# EAGLE design H26R00 (EAGLE 9.3.0)

## Sheet 1 of 2
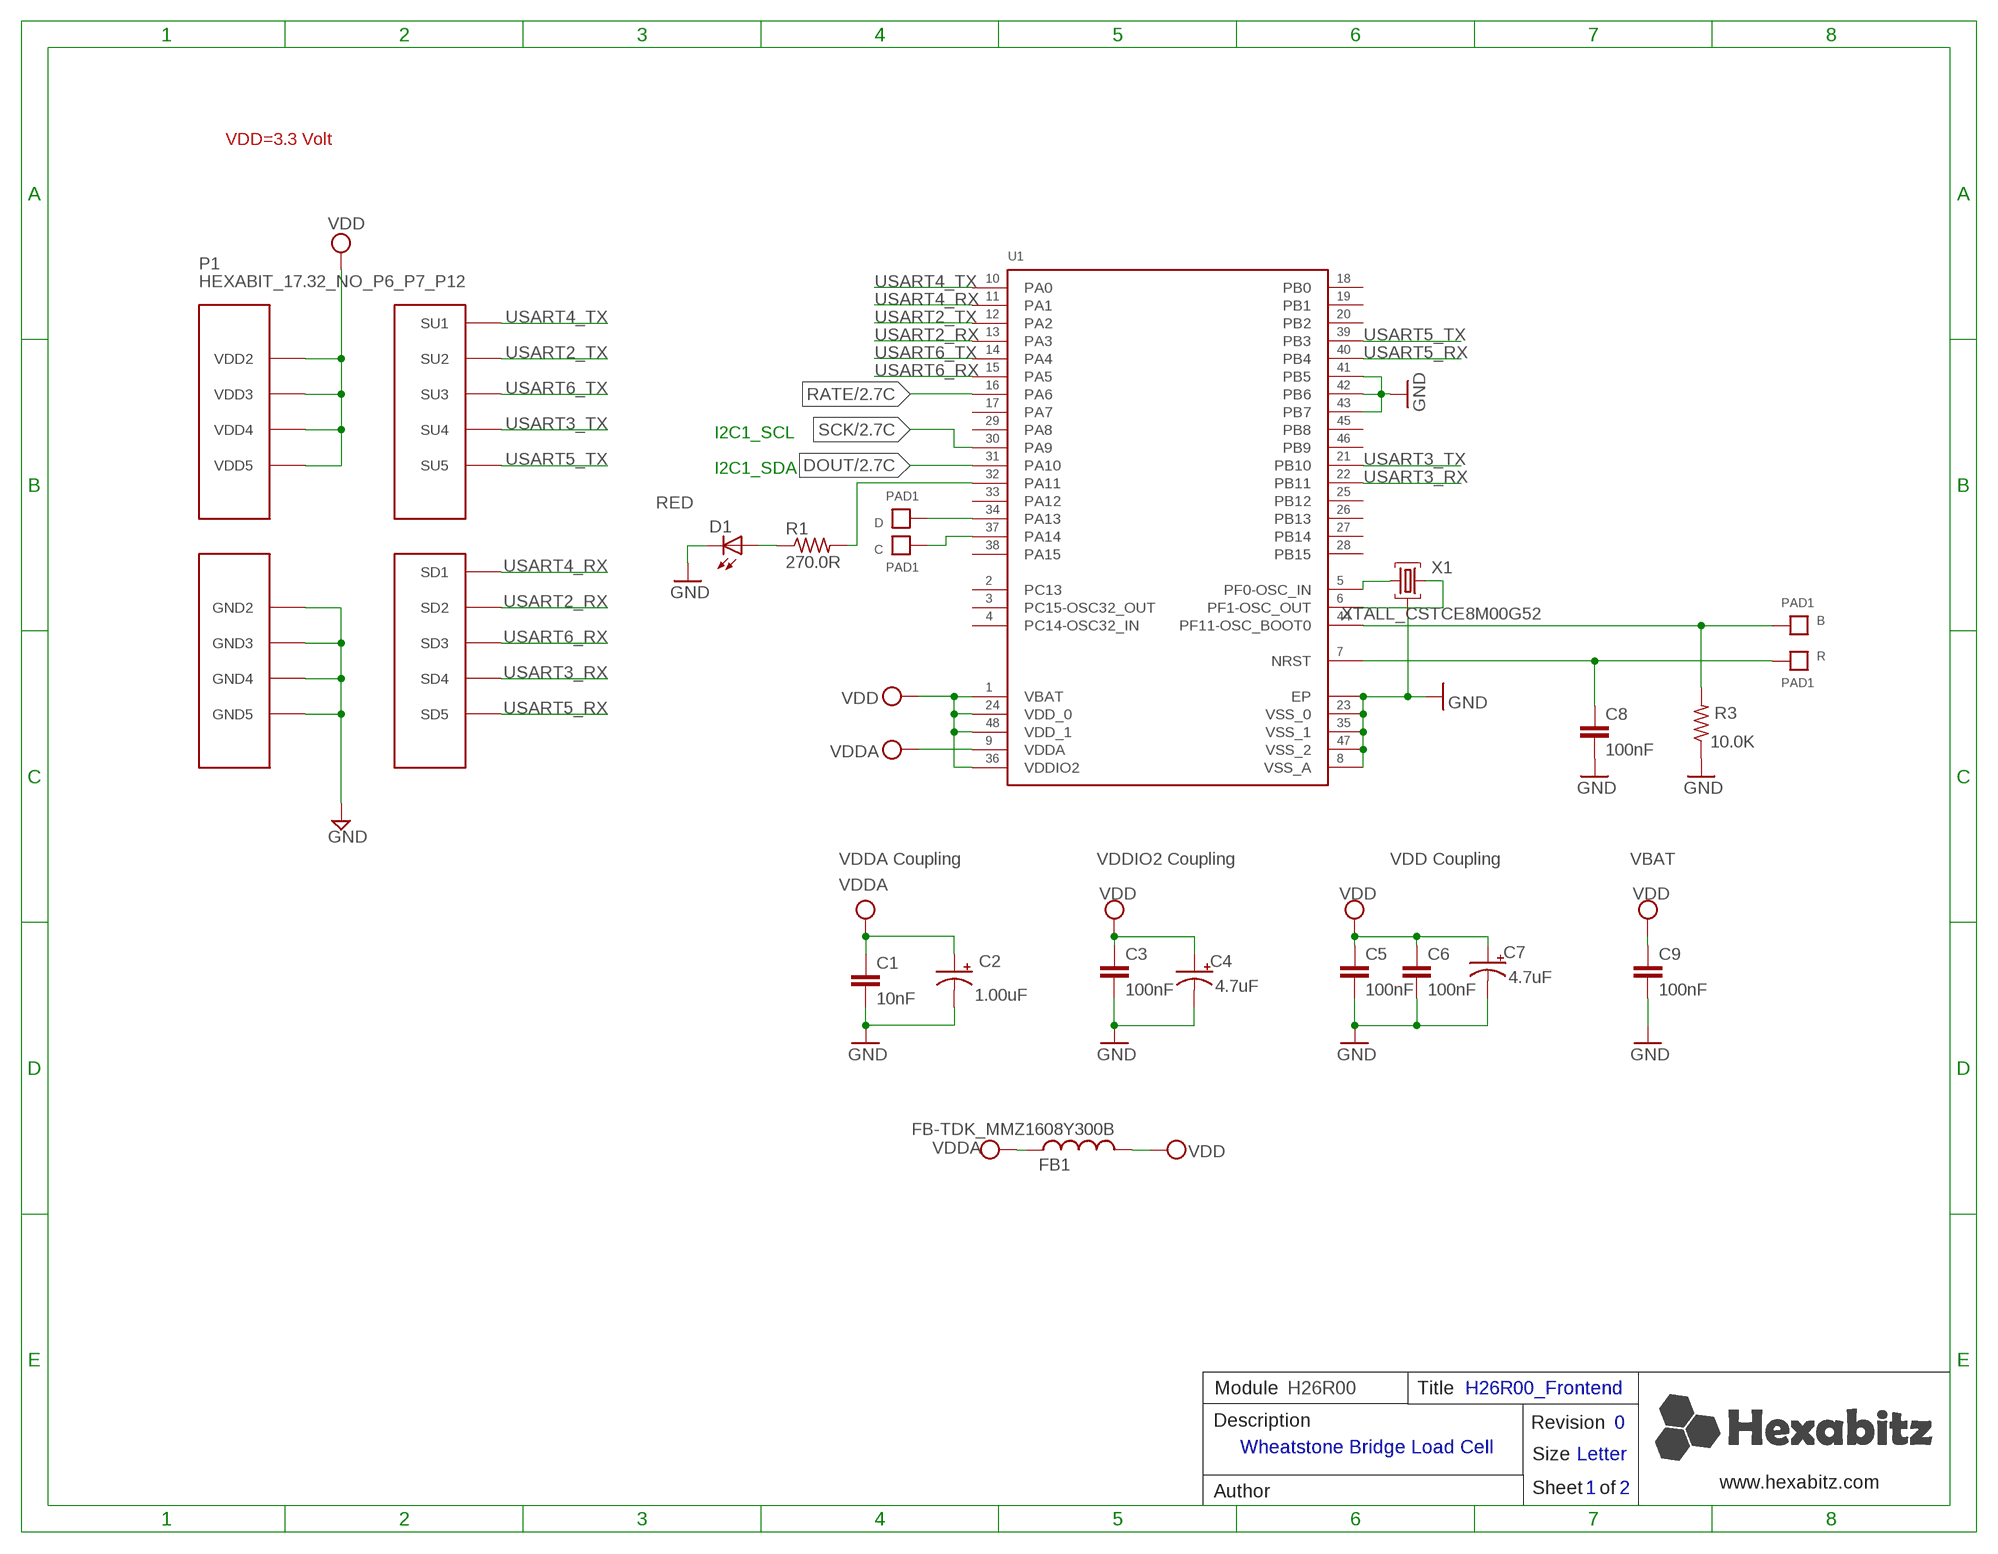
[diagram p0: schematic, sheet 1]

### Parts
B  PAD1  [PAD1]
C  PAD1  [PAD1]
C1  10nF  C-0603  [C-0603]
C2  1.00uF  C-0805-POL  [C-0805-POL]
C3  100nF  C-0603  [C-0603]
C4  4.7uF  C-0805-POL  [C-0805-POL]
C5  100nF  C-0603  [C-0603]
C6  100nF  C-0603  [C-0603]
C7  4.7uF  C-0805-POL  [C-0805-POL]
C8  100nF  C-0603  [C-0603]
C9  100nF  C-0603  [C-0603]
D  PAD1  [PAD1]
D1  RED  VLMS1300-GS08  [VLMS1300-GS08]
FB1  FB-TDK_MMZ1608Y300B  [FB-TDK_MMZ1608Y300B]
P1  HEXABIT_17.32_NO_P6_P7_P12  [HEXABIT_17.32_NO_P6_P7_P12]
R  PAD1  [PAD1]
R1  270.0R  R-0603  [R-0603]
R3  10.0K  R-0603  [R-0603]
U1  STM32F091CBU6  [STM32F091CBU6]
X1  XTALL_CSTCE8M00G52  [XTALL_CSTCE8M00G52]

### Nets
B1: B.P$1 B.P$2 R3.2 U1.P$44(PF11-OSC_BOOT0)
DOUT: U1.P$31(PA10) ; also sheet 2
GND: C1.2 C2.2(-) C3.2 C4.2(-) C5.2 C6.2 C7.2(-) C8.2 C9.2 D1.C P1.PAD_PD8(GND2) P1.PAD_PD9(GND3) P1.PAD_PD10(GND4) P1.PAD_PD11(GND5) R3.1 U1.EP U1.P$8(VSS_A) U1.P$23(VSS_0) U1.P$35(VSS_1) U1.P$41(PB5) U1.P$42(PB6) U1.P$43(PB7) U1.P$47(VSS_2) X1.P$2 ; also sheet 2
N$2: R1.2 U1.P$32(PA11)
N$4: D1.A R1.1
N$5: U1.P$5(PF0-OSC_IN) X1.P$1
N$6: U1.P$6(PF1-OSC_OUT) X1.P$3
N$7: D.P$1 D.P$2 U1.P$34(PA13)
N$9: C.P$1 C.P$2 U1.P$37(PA14)
R1: C8.1 R.P$1 R.P$2 U1.P$7(NRST)
RATE: U1.P$16(PA6) ; also sheet 2
SCK: U1.P$30(PA9) ; also sheet 2
USART2_RX: P1.PAD_PD2(SD2) U1.P$13(PA3)
USART2_TX: P1.PAD_PU2(SU2) U1.P$12(PA2)
USART3_RX: P1.PAD_PD4(SD4) U1.P$22(PB11)
USART3_TX: P1.PAD_PU4(SU4) U1.P$21(PB10)
USART4_RX: P1.PAD_PD1(SD1) U1.P$11(PA1)
USART4_TX: P1.PAD_PU1(SU1) U1.P$10(PA0)
USART5_RX: P1.PAD_PD5(SD5) U1.P$40(PB4)
USART5_TX: P1.PAD_PU5(SU5) U1.P$39(PB3)
USART6_RX: P1.PAD_PD3(SD3) U1.P$15(PA5)
USART6_TX: P1.PAD_PU3(SU3) U1.P$14(PA4)
VDD: C3.1 C4.1(+) C5.1 C6.1 C7.1(+) C9.1 FB1.2 P1.PAD_PU8(VDD2) P1.PAD_PU9(VDD3) P1.PAD_PU10(VDD4) P1.PAD_PU11(VDD5) U1.P$1(VBAT) U1.P$24(VDD_0) U1.P$36(VDDIO2) U1.P$48(VDD_1) ; also sheet 2
VDDA: C1.1 C2.1(+) FB1.1 U1.P$9(VDDA)
Unconnected: U1.P$2(PC13) U1.P$3(PC14-OSC32_IN) U1.P$4(PC15-OSC32_OUT) U1.P$17(PA7) U1.P$18(PB0) U1.P$19(PB1) U1.P$20(PB2) U1.P$25(PB12) U1.P$26(PB13) U1.P$27(PB14) U1.P$28(PB15) U1.P$29(PA8) U1.P$33(PA12) U1.P$38(PA15) U1.P$45(PB8) U1.P$46(PB9)

### Notes on the sheet
- VDD=3.3 Volt
- I2C1_SCL
- I2C1_SDA
- VDDA Coupling | VDDIO2 Coupling | VDD Coupling | VBAT
- Module | H26R00 | Title | H26R00_Frontend
- Description | Revision | 0
- Wheatstone Bridge Load Cell
- Size | Letter
- www.hexabitz.com
- Author | Sheet   of | 1 | 2
- C:/Users/Admin/Desktop/logodraft.bmp

## Sheet 2 of 2
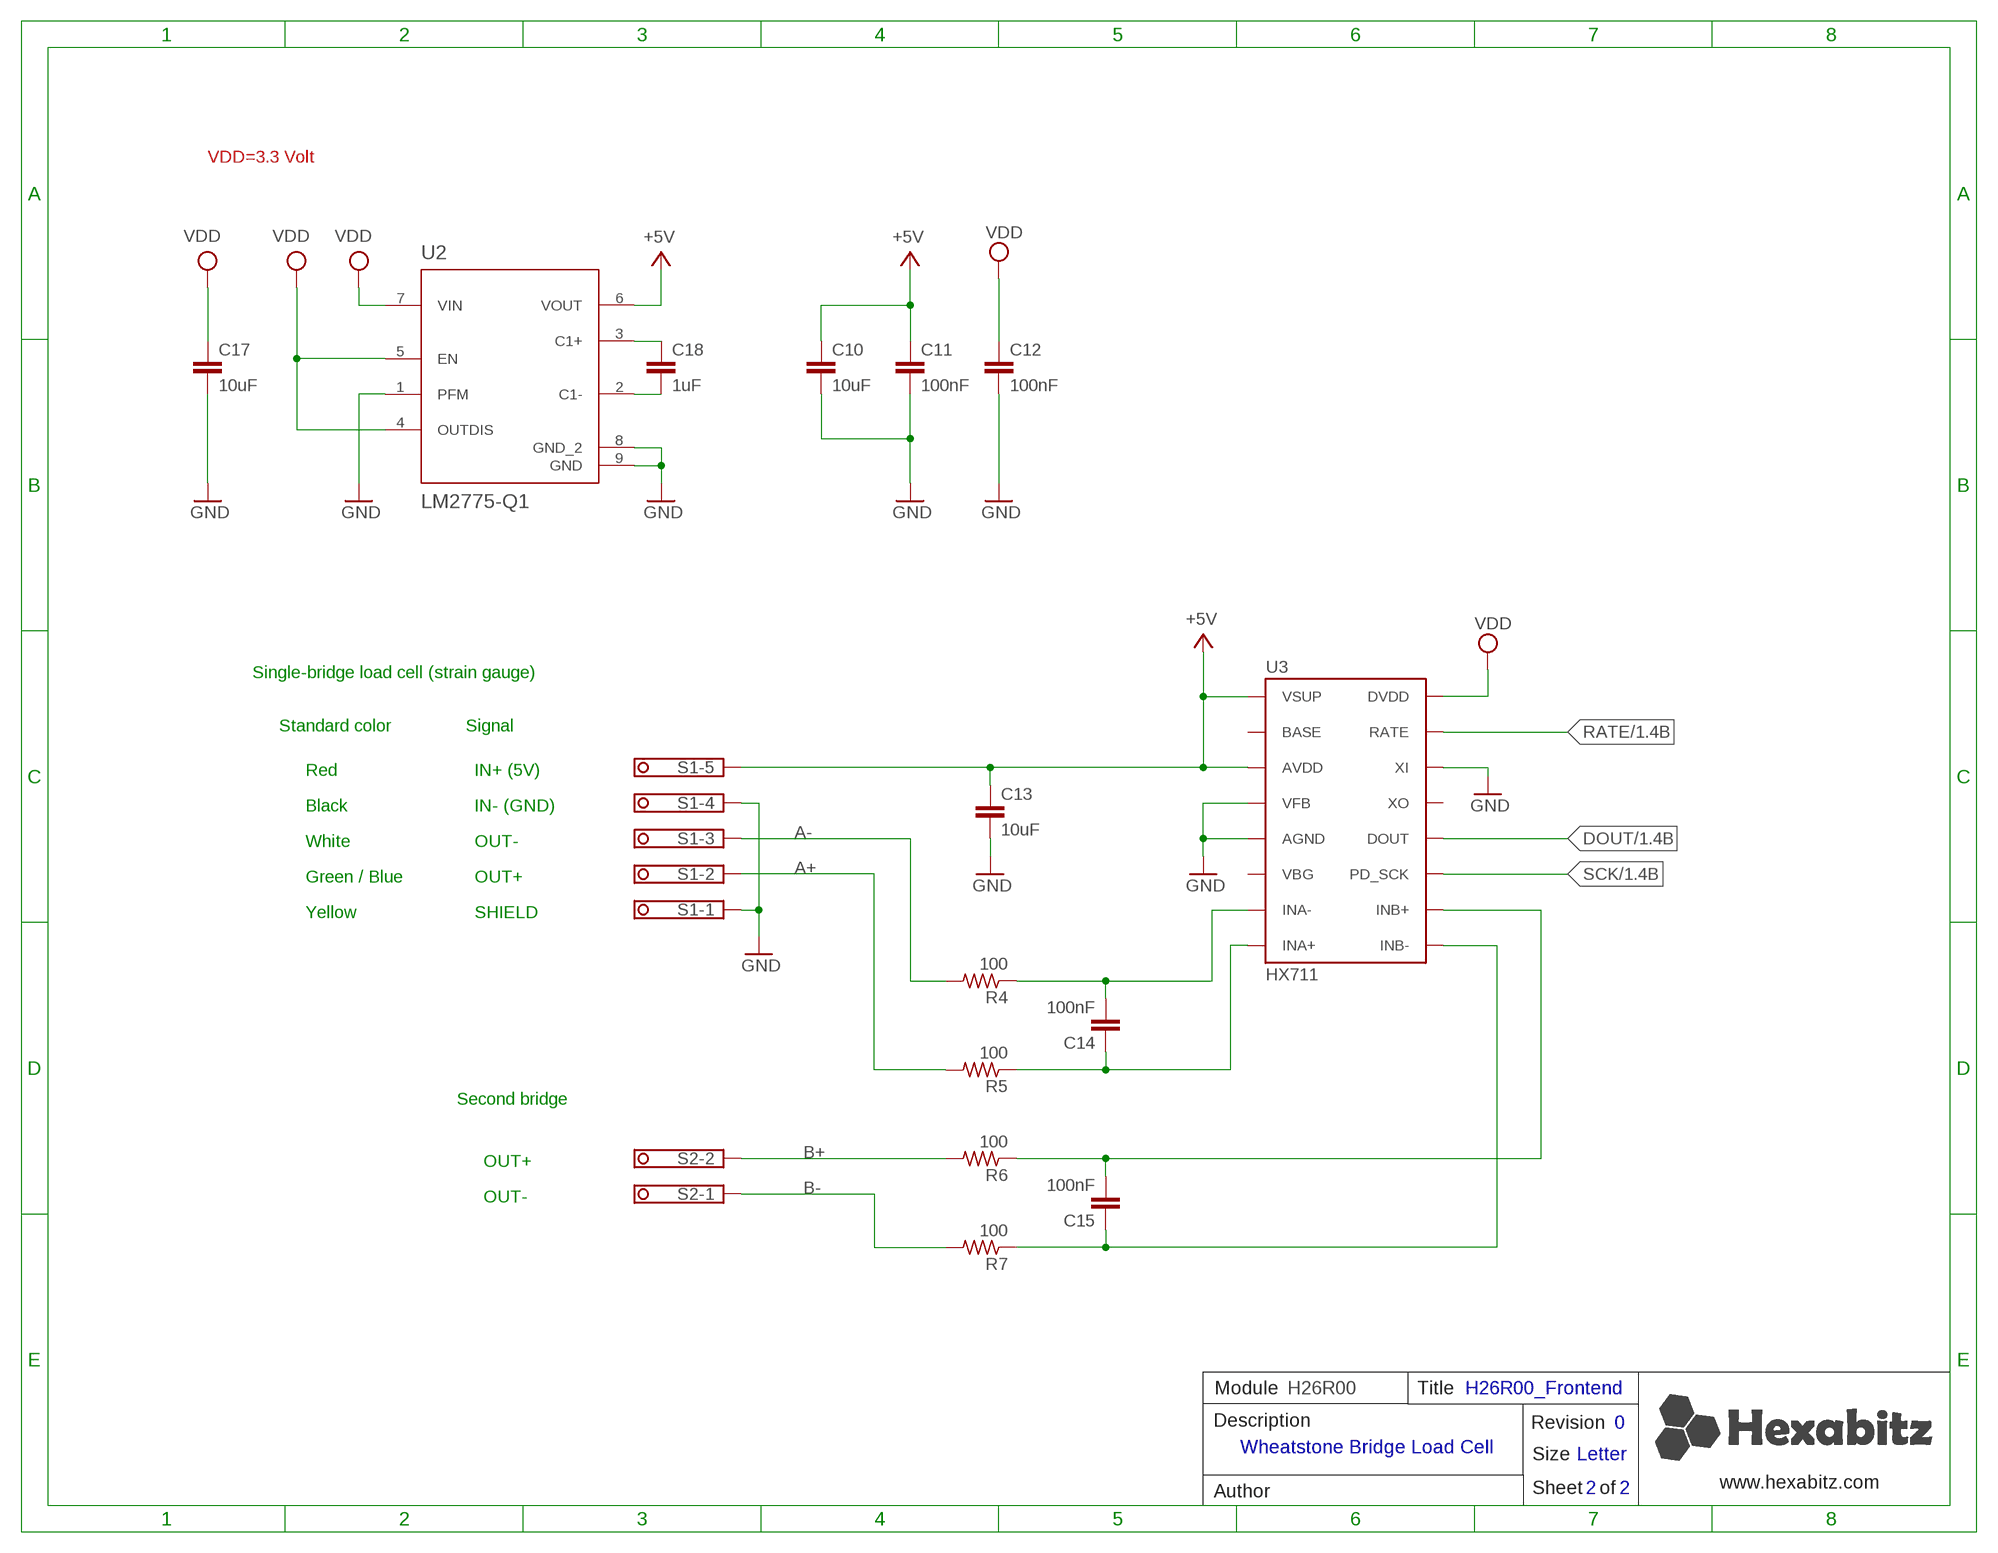
[diagram p1: schematic, sheet 2]

### Parts
C10  10uF  C-0603  [C-0603]
C11  100nF  C-0603  [C-0603]
C12  100nF  C-0603  [C-0603]
C13  10uF  C-0603  [C-0603]
C14  100nF  C-0603  [C-0603]
C15  100nF  C-0603  [C-0603]
C17  10uF  C-0603  [C-0603]
C18  1uF  C-0603  [C-0603]
R4  100  R-0603  [R-0603]
R5  100  R-0603  [R-0603]
R6  100  R-0603  [R-0603]
R7  100  R-0603  [R-0603]
S1  CON-PHOENIX-350_1751277  [CON-PHOENIX-350_1751277]
S2  CON-PHOENIX-350_1751248  [CON-PHOENIX-350_1751248]
U2  LM2775-Q1  LM2775QDSGRQ1  [DSG0008A]
U3  HX711  [HX711_SO16]

### Nets
+5V: C10.1 C11.1 C13.1 S1.5 U2.6(VOUT) U3.1(VSUP) U3.3(AVDD)
A+: R5.2 S1.2
A-: R4.2 S1.3
B+: R6.2 S2.2
B-: R7.2 S2.1
DOUT: U3.12(DOUT) ; also sheet 1
GND: C10.2 C11.2 C12.2 C13.2 C17.2 S1.1 S1.4 U2.1(PFM) U2.8(GND_2) U2.9(GND) U3.4(VFB) U3.5(AGND) U3.14(XI) ; also sheet 1
INA+: C14.1 R5.1 U3.8(INA+)
INA-: C14.2 R4.1 U3.7(INA-)
INB+: C15.2 R6.1 U3.10(INB+)
INB-: C15.1 R7.1 U3.9(INB-)
N$3: C18.1 U2.3(C1+)
N$13: C18.2 U2.2(C1-)
RATE: U3.15(RATE) ; also sheet 1
SCK: U3.11(PD_SCK) ; also sheet 1
VDD: C12.1 C17.1 U2.4(OUTDIS) U2.5(EN) U2.7(VIN) U3.16(DVDD) ; also sheet 1
Unconnected: U3.2(BASE) U3.6(VBG) U3.13(XO)

### Notes on the sheet
- VDD=3.3 Volt
- Single-bridge load cell (strain gauge)
- Standard color | Signal
- Red | IN+ (5V)
- Black | IN- (GND)
- White | OUT-
- Green / Blue | OUT+
- Yellow | SHIELD
- Second bridge
- OUT+
- OUT-
- Module | H26R00 | Title | H26R00_Frontend
- Description | Revision | 0
- Wheatstone Bridge Load Cell
- Size | Letter
- www.hexabitz.com
- Author | Sheet   of | 2 | 2

## Library data of the parts
B C D R = Hexabitz:PAD1
C1 = Hexabitz:C-0603: CAP CER 10% X7R 0603; CAPACITANCE: 10nF; MFN: KEMET; MPN: C0603C103K5RACTU; OCTOPART_URL: https://octopart.com/c0603c103k5ractu-kemet-133094?r=sp&s=R_iPBxLnSmGqhkU2rIMFpg; TOLERANCE: 10%; VOLTAGE_RATING: 50V
C2 = Hexabitz:C-0805-POL: Cap Tant Solid SMD 2012; CAPACITANCE: 1.00uF; MFN: Yageo; MPN: CC0805KKX7R7BB105; OCTOPART_URL: https://octopart.com/cc0805kkx7r7bb105-yageo-8376555?r=sp&s=YKl1wwtkROau_X5nniH2ig; TOLERANCE: 10%; VOLTAGE_RATING: 16V
C3 C6 C8 C11 C12 = Hexabitz:C-0603: CAP CER 10% X7R 0603; CAPACITANCE: 100nF; MFN: KEMET; MPN: C0603C104K8RACTU; OCTOPART_URL: https://octopart.com/c0603c104k8ractu-kemet-145075?r=sp&s=9bS9ASSwSEqMCE9KBEQZ0g; TOLERANCE: 10%; VOLTAGE_RATING: 10V
C4 C7 = Hexabitz:C-0805-POL: Cap Tant Solid SMD 2012; CAPACITANCE: 4.7uF; MFN: Murata; MPN: GRM21BC81E475KA12L; OCTOPART_URL: https://octopart.com/grm21bc81e475ka12l-murata-10331911?r=sp&s=RY3qZSD8T6mG6TC9CHI5qQ; TOLERANCE: 10%; VOLTAGE_RATING: 25V
C5 = Hexabitz:C-0603: CAP CER 10% X7R 0603; CAPACITANCE: 100nF; MFN: KEMET; MPN: C0603C104K8RACTU; OCTOPART_URL: https://octopart.com/c0603c104k8ractu-kemet-145075?r=sp&s=9bS9ASSwSEqMCE9KBEQZ0g; TOLERANCE: 10%; VOLTAGE_RATING: 10
C9 C14 C15 = Hexabitz:C-0603: CAP CER 10% X7R 0603; CAPACITANCE: 100nF; MFN: KEMET; MPN: C0603C104K8RACTU; OCTOPART_URL: https://octopart.com/c0603c104k8ractu-kemet-145075?r=sp&s=9bS9ASSwSEqMCE9KBEQZ0g; TOLERANCE: 10V; VOLTAGE_RATING: 10%
C10 C17 = Hexabitz:C-0603: CAP CER 10% X7R 0603; CAPACITANCE: 10uF; MFN: Murarta; MPN: GRM188R61A106KE69D; OCTOPART_URL: https://octopart.com/grm188r61a106ke69d-murata-22851381?r=ap&s=o9t4ILLiSny6rfdd0oM5Kg; TOLERANCE: 10%; VOLTAGE_RATING: 10V
C13 = Hexabitz:C-0603: CAP CER 10% X7R 0603; CAPACITANCE: 10uF; MFN: Murata; MPN: GRM188R61A106KE69D; OCTOPART_URL: https://octopart.com/grm188r61a106ke69d-murata-22851381?r=ap&s=o9t4ILLiSny6rfdd0oM5Kg; TOLERANCE: 10%; VOLTAGE_RATING: 10V
C18 = Hexabitz:C-0603: CAP CER 10% X7R 0603; CAPACITANCE: 1uF; MFN: Murarta; MPN: GRM188R61A105KA61J; OCTOPART_URL: https://octopart.com/grm188r61a105ka61j-murata-9221870?r=sp&s=wvtiDxTpS1CkWsFaa2pliQ; TOLERANCE: 10%; VOLTAGE_RATING: 10V
D1 = Hexabitz:VLMS1300-GS08: Red 0603 130° Clear 54 mcd 2 V Surface Mount ChipLED ; Octopart Url : http://octopart.com/vlms1300-gs08-vishay-21709201; MFN: Vishay; MPN: VLMS1300-GS08; OCTOPART_URL: https://octopart.com/vlms1300-gs08-vishay-21709201?r=sp&s=_gcP4_q8T1SC6PJQPTQ9yA
FB1 = Hexabitz:FB-TDK_MMZ1608Y300B: Ferrite Beads Multi-Layer 30Ohm 25% 100MHz 1.5A 50mOhm DCR 0603; MFN: TDK; MPN: MMZ1608Y300B; OCTOPART_URL: https://octopart.com/mmz1608y300b-tdk-368280?r=sp&s=cd9_2ZEqQ9q9UNBuQgHAiA
P1 = hexabitz_connectors:HEXABIT_?_NO_P6_P7_P12: Hexabitz Hexagon Module Connector Hexagon side length = 17.32mm. The following ports are removed: P6 P7 P12
R1 = Hexabitz:R-0603: Thick Film Resistors - SMD 0603; MFN: Yageo; MPN: RC0603FR-07270RL; OCTOPART_URL: https://octopart.com/search?q=RC0603FR-07270RL&start=0; RESISTANCE: 270.0 Ohm; TOLERANCE: 1%
R3 = Hexabitz:R-0603: Thick Film Resistors - SMD 0603; MFN: Yageo; MPN: RC0603JR-0710KL; OCTOPART_URL: https://octopart.com/search?q=RC0603JR-0710KL&start=0; RESISTANCE: 10.0K Ohm; TOLERANCE: 5%
R4-R7 = Hexabitz:R-0603: Thick Film Resistors - SMD 0603; MFN: Yageo; MPN: RC0603JR-07100RL; OCTOPART_URL: https://octopart.com/rc0603jr-07100rl-yageo-55458504?r=sp&s=j3XfnGiETZqzM9npqpV08Q; RESISTANCE: 100; TOLERANCE: 5%
S1 = Hexabitz:CON-PHOENIX-350_1751277: MKDS 1/ 5-3,5 Printklemme Nennstrom: 10 A Bemessungsspannung: 160 V Raster: 3,5 mm Polzahl: 5 Montageart: Löten Anschlussart: Schraubanschluss Anschlussrichtung vom Leiter zur Platine: 0° Source: http://eshop.phoenixcontact.com .. 1751277.pdf; MFN: Phoenix Contact; MPN: 1984646; OCTOPART_URL: https://octopart.com/1984646-phoenix+contact-50274?r=sp&s=drI_GVM4QHaL48lSCATrxQ; OC_FARNELL: unknown; OC_NEWARK: unknown
S2 = Hexabitz:CON-PHOENIX-350_1751248: 2pin Terminal Block; Printed Circuit; 10 A; 160 V; 3.5 mm; 2; 3.5 mm; 1.2 mm; M2; PA; MFN: Phoenix Contact; MPN: 1984617; OCTOPART_URL: https://octopart.com/1984617-phoenix+contact-58834?r=sp&s=Ef_UaV1JSFmY0wggQyN1Mw; OC_FARNELL: unknown; OC_NEWARK: unknown
U1 = Hexabitz:STM32F091CBU6: Description : ARM-based 32-bit MCU, CAN, 12 timers, ADC, DAC & Comm. Interface, 2 to 3.6 V, -40 to 85 degC, 48-Pin UFQFPN, RoHS, Tray ;Parameter : Ciiva URL : https://ciiva.com/part/STM32F091CBU6-20240708, CiivaID : 20240708, Clock Speed : 48000000.0 Hz, Lifecycle Status : Active, Mounting Style : Surface Mount, Number of Pins : 48, Octopart Url : https://octopart.com/stm32f091cbu6-stmicroelectronics-51988677, OctopartID : 5f4f955c32ec8088, RAM Memory Size : 32768 B, REACH SVHC Compliance : No SVHC, RoHS : Compliant,; MFN: STMicroelectronics; MPN: STM32F091CBU6; OCTOPART_URL: https://octopart.com/stm32f091cbu6-stmicroelectronics-51988677?r=sp&s=bU6fpgsrTZOxHyt7jkfh3w
U2 = Hexabitz:LM2775QDSGRQ1: Switched Capacitor 5V Boost Converter 8-WSON -40 to 125; MANUFACTURER: Texas Instruments; MFN: Texas Instruments; MPN: LM2775QDSGRQ1; OCTOPART_URL: https://octopart.com/lm2775qdsgrq1-texas+instruments-93339195?r=sp&s=OA7oim0HQqaBsU4tLKFWXg LM2775QDSGRQ1; PARTNUMBER: LM2775QDSGRQ1; REFDES: RefDes; TYPE: TYPE
U3 = Hexabitz:HX711; MFN: Avia Semiconductor; MPN: HX711
X1 = Hexabitz:XTALL_CSTCE8M00G52: MURATA CSTCE8M00G52-R0 RESONATOR, SMD, 8MHZ ; Octopart Url : https://octopart.com/cstce8m00g52-r0-murata-7145559; MFN: Murata; MPN: CSTCE8M00G52Z-R0; OCTOPART_URL: https://octopart.com/cstce8m00g52z-r0-murata-17755941?r=sp&s=JDnNJnrHQhyS8Zk4ofFWXw

## Board
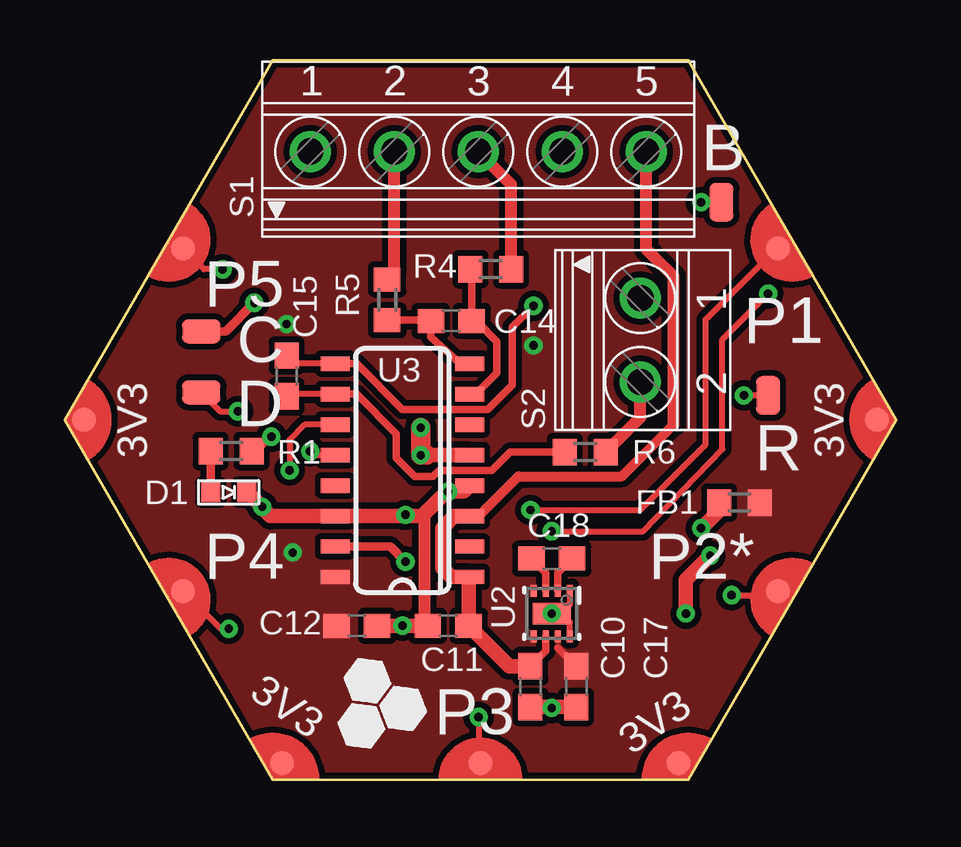
[diagram p2: board, top side]
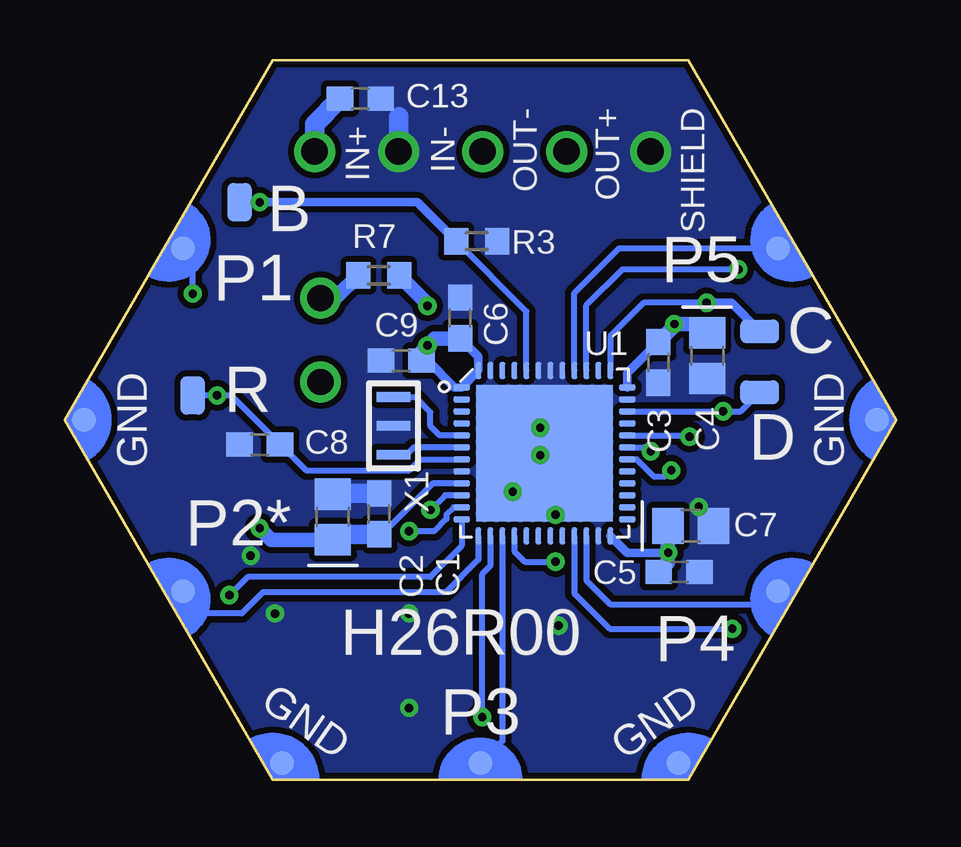
[diagram p3: board, bottom side, seen from below]

Size 34.64 x 30 mm. Coordinates in mm from the lower left corner, seen from the top.
Copper layers (1*16): Top 0.035mm / dielectric 1.5mm / Bottom 0.035mm
Design rules "2_layer": minimum track width 7mil, minimum drill 10mil, track to track 6mil, track to pad 6mil, pad to pad 6mil, via to via 6mil, smd to smd 0mil, copper to edge 1mil, drill to drill 8mil, minimum pad ring 10mil, minimum via ring 8mil, stop-mask expansion 2mil, vias tented up to drill 15mil, thermal gap 10mil

### Footprints (pad centres in the part's own frame; a part is rotated, then mirrored left to right if it is on the bottom)
PAD1 = smd 1.6 x 1: P$1 0,0 | smd 1.6 x 1 bottom: P$2 0,0
C-0603 = smd 1.1 x 1: 1 -0.85,0; 2 0.85,0
C-0805-POL = smd 1.3 x 1.5: 1 -0.95,0; 2 0.95,0
VLMS1300-GS08 = smd 0.8 x 0.8: A 0,0.75; C 0,-0.75
FB-TDK_MMZ1608Y300B = smd 1 x 1.1: 1 -0.85,0; 2 0.85,0
HEXABIT_17.32_NO_P6_P7_P12 = smd 1 x 1 bottom: PAD_PD1 12.39,7.15; PAD_PD2 12.39,-7.15; PAD_PD3 0,-14.31; PAD_PD4 -12.39,-7.15; PAD_PD5 -12.39,7.15; PAD_PD8 16.52,0; PAD_PD9 8.26,-14.31; PAD_PD10 -8.26,-14.31; PAD_PD11 -16.52,0 | smd 1 x 1: PAD_PU1 12.39,7.15; PAD_PU2 12.39,-7.15; PAD_PU3 0,-14.31; PAD_PU4 -12.39,-7.15; PAD_PU5 -12.39,7.15; PAD_PU8 16.52,0; PAD_PU9 8.26,-14.31; PAD_PU10 -8.26,-14.31; PAD_PU11 -16.52,0
R-0603 = smd 1 x 1.1: 1 -0.85,0; 2 0.85,0
CON-PHOENIX-350_1751277 = drill 1.1 pad 1.7: 1 -7,-0.1; 2 -3.5,-0.1; 3 0,-0.1; 4 3.5,-0.1; 5 7,-0.1
CON-PHOENIX-350_1751248 = drill 1.1 pad 1.7: 1 -1.75,-0.1; 2 1.75,-0.1
STM32F091CBU6 = smd 5.7 x 5.7: EP 0,0 | smd 0.25 x 0.7: P$1 -2.75,-3.45; P$2 -2.25,-3.45; P$3 -1.75,-3.45; P$4 -1.25,-3.45; P$5 -0.75,-3.45; P$6 -0.25,-3.45; P$7 0.25,-3.45; P$8 0.75,-3.45; P$9 1.25,-3.45; P$10 1.75,-3.45; P$11 2.25,-3.45; P$12 2.75,-3.45; P$25 2.75,3.45; P$26 2.25,3.45; P$27 1.75,3.45; P$28 1.25,3.45; P$29 0.75,3.45; P$30 0.25,3.45; P$31 -0.25,3.45; P$32 -0.75,3.45; P$33 -1.25,3.45; P$34 -1.75,3.45; P$35 -2.25,3.45; P$36 -2.75,3.45 | smd 0.7 x 0.25: P$13 3.45,-2.75; P$14 3.45,-2.25; P$15 3.45,-1.75; P$16 3.45,-1.25; P$17 3.45,-0.75; P$18 3.45,-0.25; P$19 3.45,0.25; P$20 3.45,0.75; P$21 3.45,1.25; P$22 3.45,1.75; P$23 3.45,2.25; P$24 3.45,2.75; P$37 -3.45,2.75; P$38 -3.45,2.25; P$39 -3.45,1.75; P$40 -3.45,1.25; P$41 -3.45,0.75; P$42 -3.45,0.25; P$43 -3.45,-0.25; P$44 -3.45,-0.75; P$45 -3.45,-1.25; P$46 -3.45,-1.75; P$47 -3.45,-2.25; P$48 -3.45,-2.75
DSG0008A = smd 0.5 x 0.25: 1 -0.95,0.75; 2 -0.95,0.25; 3 -0.95,-0.25; 4 -0.95,-0.75; 5 0.95,-0.75; 6 0.95,-0.25; 7 0.95,0.25; 8 0.95,0.75 | smd 0.9 x 1.6: 9 0,0
HX711_SO16 = smd 0.6 x 1.2: 1 -4.445,-2.8; 2 -3.175,-2.8; 3 -1.905,-2.8; 4 -0.635,-2.8; 5 0.635,-2.8; 6 1.905,-2.8; 7 3.175,-2.8; 8 4.445,-2.8; 9 4.445,2.8; 10 3.175,2.8; 11 1.905,2.8; 12 0.635,2.8; 13 -0.635,2.8; 14 -1.905,2.8; 15 -3.175,2.8; 16 -4.445,2.8
XTALL_CSTCE8M00G52 = smd 1.4 x 0.4: P$1 0,1.2; P$2 0,0; P$3 0,-1.2

### Placement (x,y rotation side)
B  27.35,24.07 90 top
C  5.69,18.68 0 top
C1  21.54,11.08 90 bottom
C2  23.47,10.95 90 bottom
C3  9.9,17.39 270 bottom
C4  7.87,17.67 270 bottom
C5  9.04,8.65 0 bottom
C6  18.16,19.24 90 bottom
C7  8.56,10.58 0 bottom
C8  26.51,13.97 180 bottom
C9  20.62,17.46 180 bottom
C10  19.4,3.87 270 top
C11  15.97,6.41 180 top
C12  12.16,6.41 0 top
C13  22.32,28.39 0 bottom
C14  16.1,19.11 0 top
C15  9.24,16.83 270 top
C17  21.31,3.87 270 top
C18  20.29,9.21 0 top
D  5.69,16.14 180 top
D1  6.83,11.98 90 top
FB1  28.11,11.55 0 top
P1  17.32,15 0 top
R  29.31,16.02 90 top
R1  6.93,13.69 0 top
R3  17.48,22.44 180 bottom
R4  17.75,21.27 0 top
R5  13.43,20 90 top
R6  21.69,13.65 0 top
R7  21.56,21.02 180 bottom
S1  17.23,26.28 0 top
S2  24.08,18.32 270 top
U1  14.65,13.6 270 bottom
U2  20.29,6.92 270 top
U3  14.07,12.89 90 top
X1  20.95,14.75 0 bottom

### Tracks (layer width: path | path; a pad name or v marks a point on that pad's centre or on a via)
+5V
  Top 0.305: U2.6 20.04,5.36 C10.1
  Top 0.406: U3.3 17.24,10.99 18.89,12.64 23.21,12.64 25.37,14.8
  Top 0.508: S1.5 24.23,22.12 25.37,20.97 25.37,14.8
  Top 0.61: C10.1 18.51,4.72 C11.1 16.82,8.4 U3.1 16.1,8.45 15.72,8.83 15.72,10.48 16.23,10.99 U3.3
  Bottom 0.813: C13.1 24.23,27.33 S1.5
A+
  Top 0.305: R5.2 13.73,21.15
  Top 0.508: 13.73,21.15 S1.2
A-
  Top 0.508: R4.2 18.6,24.81 S1.3
B1  (via drill 0.35)
  Top 0.356: B.P$1 v26.51,24.07
  Bottom 0.254: U1.P$44 15.4,19.52 R3.2
  Bottom 0.356: R3.2 19.96,24.07 v26.51,24.07 B.P$1
B+
  Top 0.508: R6.2 23.98,15.1 S2.2
B-
  Bottom 0.61: R7.2 23.3,20.13 23.93,20.13 S2.1
DOUT  (via drill 0.35)
  Top 0.254: v10.22,13.69 10.51,13.53 U3.12
  Bottom 0.254: U1.P$31 10.51,13.85 v10.22,13.69
GND  (via drill 0.35)
  Top 0.254: U2.1 21.04,7.29 20.67,6.92 | 20.67,6.92 U2.9 | U2.8 21.04,6.55 20.67,6.92
  Top 0.305: U3.4 16.48,12.26
  Top 0.508: C11.2 14.98,6.56 14.98,11.07
  Top 0.61: U3.5 15.08,13.53 | D1.C 7.62,11.98 v8.23,11.37 8.23,11.33 8.57,10.99 U3.14 14.9,10.99 | C12.2 v14.07,6.41 C11.2 | U3.4 16.61,12 v15.97,12 15.91,12 14.98,11.07 | v26.9,9.34 25.88,8.32 v25.88,6.92 | C17.2 20.33,3.02 v20.29,2.99 20.25,3.02 C10.2
  Top 0.813: v14.83,14.67 14.83,13.78 | 14.83,13.78 15.08,13.53 | v14.83,13.53 14.83,13.78
  Bottom 0.813: 20.73,27.64 S1.4 | C1.2 23.38,11.93 C2.2
  other vias: 14.2,11.03 20.29,6.92
  pour Bottom (isolate 0.254, no thermals): 8.66,0 25.98,0 34.64,15 25.98,30 8.66,30 0,15
INA+
  Top 0.305: U3.8 16.48,17.34 15.25,18.44 C14.1 15.21,19.15 R5.1
INA-
  Top 0.305: R4.1 16.95,21.22 C14.2 17.16,19.11 18.01,18.26 18.01,16.96 17.12,16.07 U3.7
INB+
  Top 0.254: U3.10 9.33,16.07 C15.2
  Top 0.305: R6.1 18.55,13.65 17.79,12.89 15.59,12.89 15.34,12.64 14.58,12.64 13.81,13.4 13.81,14.42 12.16,16.07 U3.10
INB-  (via drill 0.35)
  Top 0.254: U3.9 9.58,17.34 C15.1
  Top 0.305: U3.9 12.16,17.34 14.07,15.43 17.62,15.43 18.64,16.45 18.64,18.86 v19.53,19.75
  Bottom 0.61: R7.1 19.53,19.84 v19.53,19.75
N$2  (via drill 0.35)
  Top 0.254: v8.61,14.29 8.01,13.69 R1.2
  Bottom 0.254: U1.P$32 8.67,14.35 v8.61,14.29
N$3
  Top 0.305: U2.3 20.04,8.61 C18.1
N$4
  Top 0.356: R1.1 6.08,12.18 D1.A
N$5
  Bottom 0.254: X1.P$1 20.04,15.95 19.4,15.3 19.4,14.73 19.02,14.35 U1.P$5
N$6
  Bottom 0.254: U1.P$6 20.09,13.85 20.4,13.55 X1.P$3
N$7  (via drill 0.35)
  Top 0.254: D.P$1 6.48,15.35 v7.21,15.35
  Bottom 0.254: U1.P$34 v7.21,15.35 6.48,15.35 D.P$1
N$9  (via drill 0.35)
  Top 0.356: v7.9,19.88 6.7,18.68 C.P$1
  Bottom 0.254: v7.9,19.88 10.51,19.88 11.9,18.49 U1.P$37
  Bottom 0.356: v7.9,19.88 6.88,19.88 C.P$1
N$13
  Top 0.305: U2.2 20.54,8.61 C18.2
R1  (via drill 0.35)
  Top 0.254: R.P$1 v28.29,16.02
  Bottom 0.254: U1.P$7 19.83,13.35 20.29,12.89 24.59,12.89 C8.1 27.71,16.02 v28.29,16.02 R.P$1
RATE  (via drill 0.35)
  Top 0.356: v14.2,9.08 13.56,9.72 U3.15
  Bottom 0.254: U1.P$16 15.9,9.52 15.47,9.08 v14.2,9.08
SCK  (via drill 0.35)
  Top 0.254: U3.11 10,14.8 9.37,14.16 v9.37,12.89
  Bottom 0.254: v9.37,12.89 9.62,12.64 10.1,12.64 10.82,13.35 U1.P$30
USART2_RX
  Bottom 0.254: U1.P$13 17.4,9.18 18.77,7.81 26.39,7.81 27.28,6.92 28.93,6.92 29.71,7.7 P1.PAD_PD2
USART2_TX  (via drill 0.35)
  Top 0.254: v27.78,7.68 29.54,7.68 P1.PAD_PU2
  Bottom 0.254: U1.P$12 18.1,9.75 19.4,8.45 27.02,8.45 v27.78,7.68
USART3_RX
  Bottom 0.254: P1.PAD_PD4 5.48,7.3 11.91,7.3 12.9,8.3 U1.P$22
USART3_TX  (via drill 0.35)
  Top 0.254: v6.83,6.29 6.49,6.29 P1.PAD_PU4
  Bottom 0.254: U1.P$21 13.4,7.76 11.93,6.29 v6.83,6.29
USART4_RX  (via drill 0.35)
  Top 0.254: v20.29,10.35 24.08,10.35 27.4,13.78 27.4,18.35 v29.31,20.26
  Bottom 0.254: U1.P$11 18.44,11.35 18.74,11.04 18.74,10.86 19.25,10.35 v20.29,10.35 | v29.31,20.26 29.31,21.75 P1.PAD_PD1
USART4_TX  (via drill 0.35)
  Top 0.254: v19.4,11.24 23.97,11.24 26.7,13.97 26.7,19.18 29.68,22.15 P1.PAD_PU1
  Bottom 0.254: U1.P$10 18.79,11.85 v19.4,11.24
USART5_RX
  Bottom 0.254: P1.PAD_PD5 11.54,22.15 13.4,20.29 U1.P$40
USART5_TX  (via drill 0.35)
  Top 0.254: v6.58,21.27 5.81,21.27 P1.PAD_PU5
  Bottom 0.254: U1.P$39 12.9,19.77 11.4,21.27 v6.58,21.27
USART6_RX
  Bottom 0.254: U1.P$15 16.4,1.61 P1.PAD_PD3
USART6_TX  (via drill 0.35)
  Top 0.254: v17.24,2.6 17.24,0.77 P1.PAD_PU3
  Bottom 0.254: U1.P$14 16.9,8.91 17.24,8.57 v17.24,2.6
VDD  (via drill 0.35)
  Top 0.305: 20.54,5.49 C17.1
  Bottom 0.356: U1.P$36 11.2,16.94 C3.1 | C6.1 17.4,17.64 U1.P$48 U1.P$1 18.41,16.35 19.52,17.46 C9.1 | U1.P$24 11.2,9.45 v9.51,9.45
  Bottom 0.61: C6.1 19.22,18.39 19.77,17.84 C9.1 19.53,17.71 v19.53,18.1 | C3.1 9.24,18.9 v9.24,18.99 8.24,18.99 C4.1 | C5.1 9.51,9.03 v9.51,9.45 arc90 v9.5,9.46 arc90 9.51,9.47 C7.1
  pour Top (isolate 0.254, no thermals): 8.66,0 25.98,0 34.64,15 25.98,30 8.66,30 0,15
VDDA  (via drill 0.35)
  Top 0.61: v26.51,10.48 27.26,11.22 FB1.1
  Bottom 0.254: U1.P$9 19.31,12.35 21.43,10.23 C1.1
  Bottom 0.61: C2.1 26.03,10 v26.51,10.48
  Bottom 0.813: C1.1 23.24,10.23 C2.1

### Text on the board
tPlace: P5 | P1 | 3V3 | 3V3 | P4 | P2* | 3V3 | P3 | 3V3
bPlace: P5 | P1 | GND | GND | P2* | P4 | H26R00 | GND | P3 | GND
bNames: SHIELD | OUT+ | OUT- | IN- | IN+ | B | C | R | D